# Altium project IR_Sensor.PrjPcb
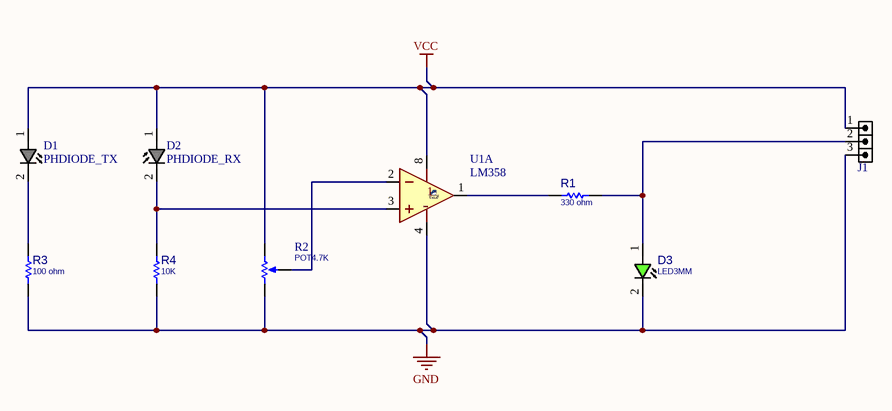
[diagram p0: Sheet1.SchDoc]
1 sheet, 9 parts. Net scope: global (net labels, ports and power ports of the same name join across sheets).
Board files: PCB1.PcbDoc, PCB2_Panel.PcbDoc

## Sheet Sheet1.SchDoc
size A4; SheetNumber: 1; SheetTotal: 1

### Parts
D1  PHDIODE_TX  [LED3MM]
D2  PHDIODE_RX  [LED3MM]
D3  LED3MM  [LED3MM]
J1  HDRM3  [HDRR_M_1X3]  (value not drawn)
R1  330 ohm  [R025W_AX04]
R2  POT4.7K  [POT_PIHER15MM]
R3  100 ohm  [R025W_AX04]
R4  10K  [R025W_AX04]
U1  LM358  [DIP_8]  (part A of 2)

### Nets
GND: D3.2(CATHODE) J1.3 R2.1(TOP) R3.1 R4.1 U1.4(V-)
VCC: D1.1(ANODE) D2.1(ANODE) J1.1 R2.3(BOT) U1.8(V+)
NetD1_2: D1.2(CATHODE) R3.2
NetD2_2: D2.2(CATHODE) R4.2 U1.3(IN+)
NetD3_1: D3.1(ANODE) J1.2 R1.1
NetR1_2: R1.2 U1.1(OUT)
NetR2_2: R2.2(TAP) U1.2(IN-)

### Library data of the parts
D1 = PHDIODE_TX: LED, Infrared Transmitter; MANF: -; MANF_P#: -; PARAM2: -; PARAM: -; PRICE: 100toman@JAVAN; Value: PHDIODE_TX
D2 = PHDIODE_RX: LED, Infrared Receiver; MANF: -; MANF_P#: -; PARAM2: -; PARAM: -; PRICE: 100toman@JAVAN; Value: PHDIODE_RX
D3 = LED_THD_3MM: LED, THD, 3MM, GREEN; DESC: DESCRIPTION; MANF_P#: MANF_PART#; PARAM2: 2.2V; MANF: MANF; ASSEMBLY: ASSEMBLY; PRICE: PRICE; VALUE: LED3MM
J1 = HDRR_M_1X3: CONN, HEADER, RightAngle, Male, pitch: 2.54mm, 3POS; VALUE: HDRM3
R1 R3 R4 = RES_THD: RESISTOR, THD; MANF_P#: RK73H1ETTP4701F; MANF: KOA SPEER; PARAM: 0.063W; DESC: DESCRIPTION; DIST#: MOUSER; PARAM2: 1%; ASSEMBLY: ASSEMBLY; PRICE: 100= 0.5$
  R1: VALUE: 330 ohm
  R3: VALUE: 100 ohm
  R4: VALUE: 10K
R2 = RES_THD_POT_PT15: RESISTOR, THD, Potentiometer, PT-15 15mm; MANF: PIHER; MANF_P#: PT15NV15; PARAM2: 150mW; PARAM: 20%, -25~70oC; PRICE: 0.6$; VALUE: POT4.7K
U1 = LM358_DIP8: AMP, Dual, Low-Power; MANF: Texas Instruments, Fairchild; MANF_P#: LM358AN; PARAM2: 3 V ~ 32 V, ±1.5 V ~ 16 V; PRICE: -; VALUE: LM358